# EAGLE design WSN_Gateway_v4.1 (EAGLE 8.2.2)
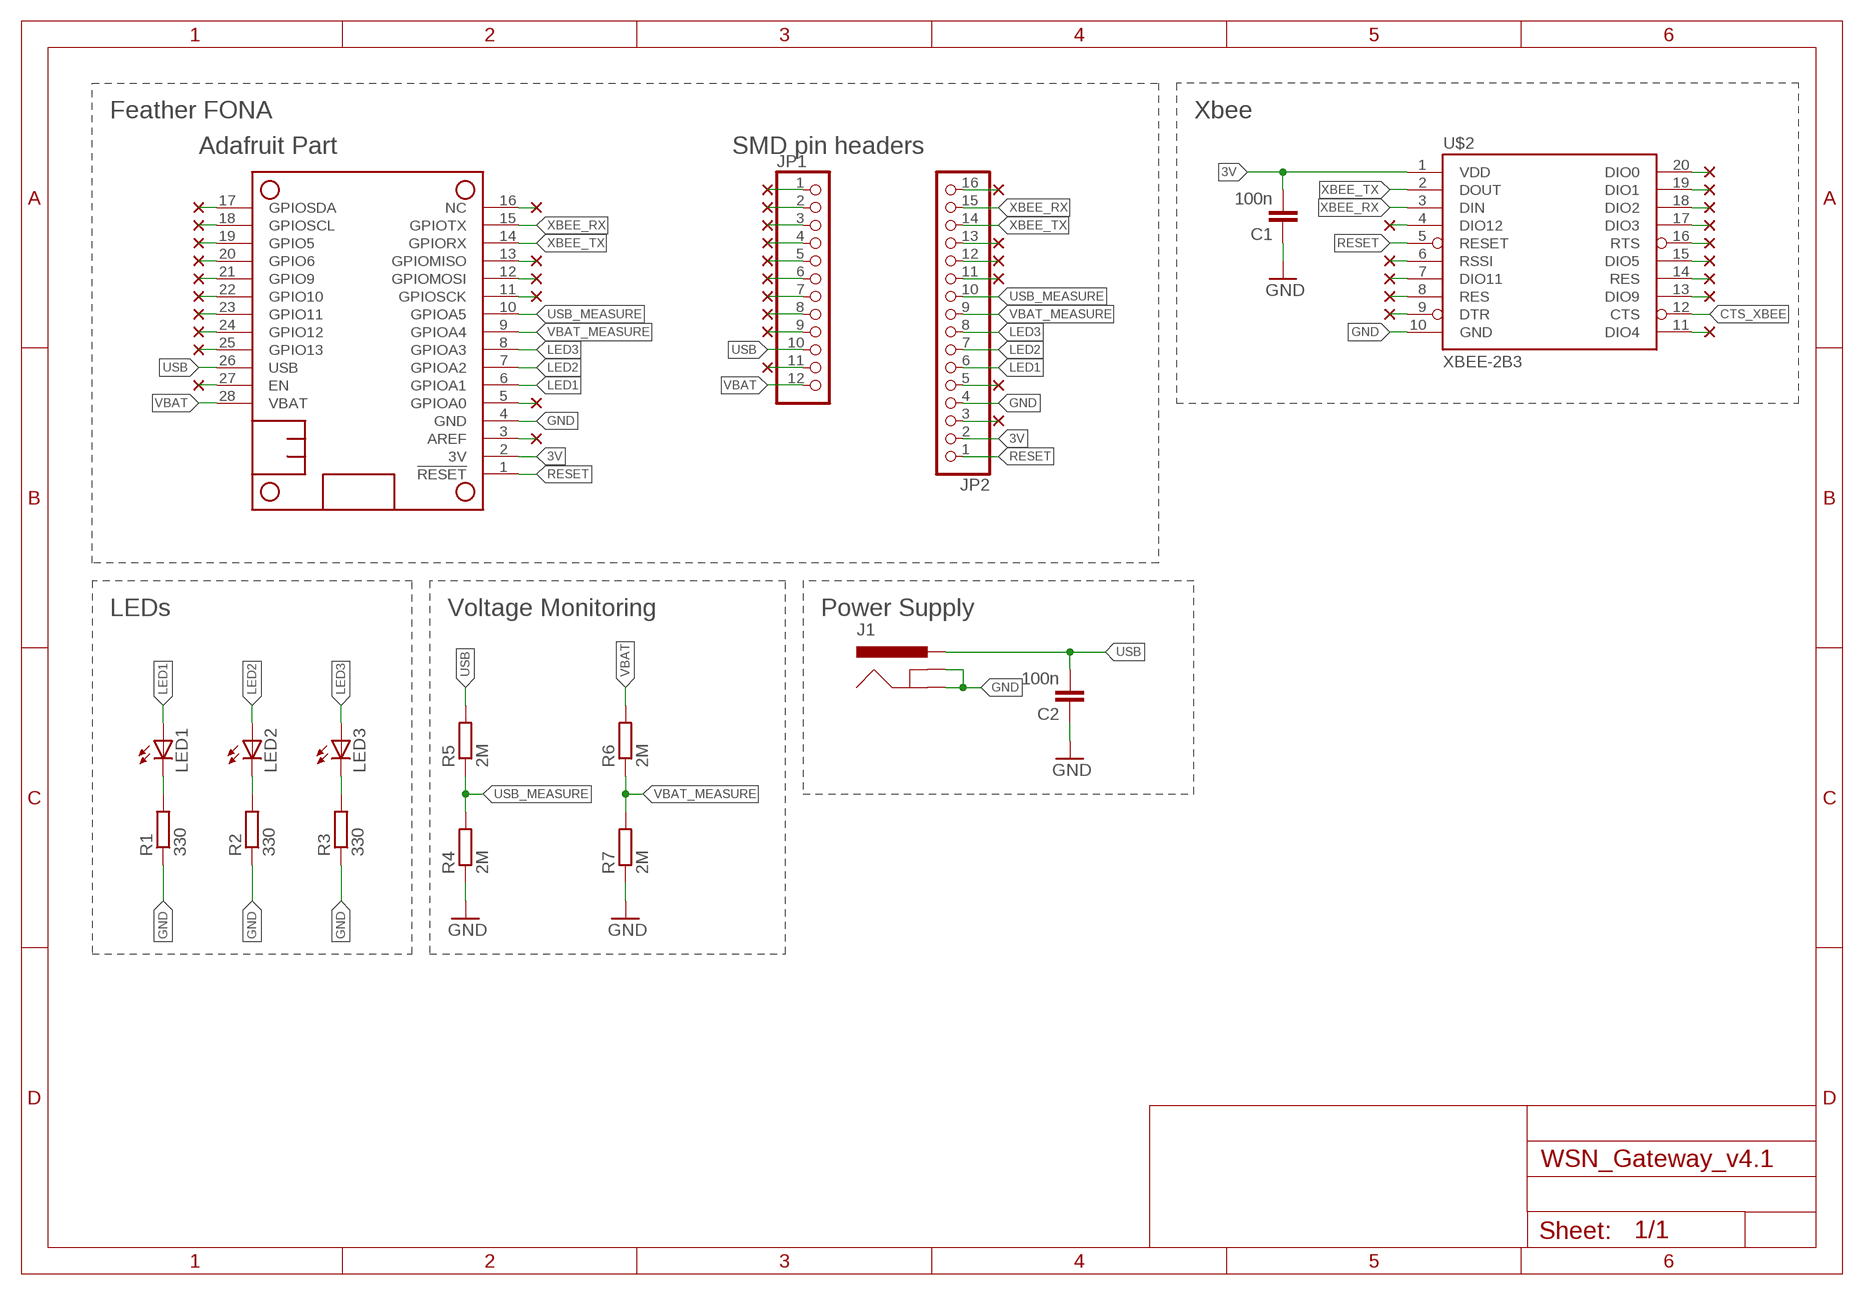
[diagram p0: schematic, sheet 1]

## Parts
C1  100n  C  [C0805]
C2  100n  C  [C0805]
J1  5.5x2.1mm Barrel  POWER_JACKSMD  [POWER_JACK_SMD]
JP1  PINHD-1X121X12_SMT  [1X12_SMT]
JP2  PINHD-1X161X16_SMT  [1X16_SMT]
LED1  LEDCHIPLED_0805  [CHIPLED_0805]
LED2  LEDCHIPLED_0805  [CHIPLED_0805]
LED3  LEDCHIPLED_0805  [CHIPLED_0805]
MS1  FEATHERWING_NODIM_NOHOLES  [FEATHERWING_DIM_2]
R1  330  R-EU_R0805  [R0805]
R2  330  R-EU_R0805  [R0805]
R3  330  R-EU_R0805  [R0805]
R4  2M  R-EU_R0805  [R0805]
R5  2M  R-EU_R0805  [R0805]
R6  2M  R-EU_R0805  [R0805]
R7  2M  R-EU_R0805  [R0805]
U$2  XBEE-2B3  [XBEE-SMD]

## Nets
3V: C1.2 JP2.2 MS1.2(3V) U$2.1(VDD)
CTS_XBEE: U$2.12(CTS)
GND: C1.1 C2.1 J1.GND(GNDBREAK) J1.P$4(GND) JP2.4 MS1.4(GND) R1.1 R2.1 R3.1 R4.1 R7.1 U$2.10(GND)
LED1: JP2.6 LED1.A MS1.6(GPIOA1)
LED2: JP2.7 LED2.A MS1.7(GPIOA2)
LED3: JP2.8 LED3.A MS1.8(GPIOA3)
N$1: LED1.C R1.2
N$2: LED2.C R2.2
N$3: LED3.C R3.2
N$4: MS1.25(GPIO13)
N$5: MS1.24(GPIO12)
N$6: MS1.23(GPIO11)
N$7: MS1.22(GPIO10)
N$8: MS1.21(GPIO9)
N$9: MS1.20(GPIO6)
N$10: MS1.19(GPIO5)
N$11: MS1.18(GPIOSCL)
N$12: MS1.17(GPIOSDA)
N$13: MS1.16(NC)
N$14: MS1.13(GPIOMISO)
N$15: MS1.12(GPIOMOSI)
N$16: MS1.11(GPIOSCK)
N$17: MS1.5(GPIOA0)
N$18: MS1.3(AREF)
N$19: JP1.1
N$20: MS1.27(EN)
N$21: JP1.2
N$22: JP1.3
N$23: JP1.4
N$24: JP1.5
N$25: JP1.6
N$26: JP1.7
N$27: JP1.8
N$28: JP1.9
N$29: U$2.6(RSSI)
N$30: JP1.11
N$31: U$2.4(DIO12)
N$32: JP2.16
N$33: U$2.7(DIO11)
N$34: U$2.8(RES)
N$35: JP2.13
N$36: JP2.12
N$37: JP2.11
N$38: U$2.9(DTR)
N$39: U$2.20(DIO0)
N$40: U$2.19(DIO1)
N$41: U$2.18(DIO2)
N$42: U$2.17(DIO3)
N$43: JP2.5
N$44: U$2.16(RTS)
N$45: JP2.3
N$46: U$2.15(DIO5)
N$47: U$2.14(RES)
N$48: U$2.13(DIO9)
N$49: U$2.11(DIO4)
RESET: JP2.1 MS1.1(!RESET) U$2.5(RESET)
USB: C2.2 J1.VIN0(PWR) J1.VIN1(PWR) JP1.10 MS1.26(USB) R5.2
USB_MEASURE: JP2.10 MS1.10(GPIOA5) R4.2 R5.1
VBAT: JP1.12 MS1.28(VBAT) R6.2
VBAT_MEASURE: JP2.9 MS1.9(GPIOA4) R6.1 R7.2
XBEE_RX: JP2.15 MS1.15(GPIOTX) U$2.3(DIN)
XBEE_TX: JP2.14 MS1.14(GPIORX) U$2.2(DOUT)

## Notes on the sheet
- Feather FONA | Xbee
- Adafruit Part | SMD pin headers
- LEDs | Voltage Monitoring | Power Supply

## Library data of the parts
C1 C2 = wsn:C: CAPACITOR, European symbol; SPICEMODEL: NONE; SPICEPREFIX: C
J1 = wsn:POWER_JACK: Power Jack This is the standard 5.5mm barrel jack for power. The PTH is the most common, proven, reliable, footprint. The Slot footprint only works if the mill layer is transmitted to the PCB fab house so be warned. Mating wall wart : TOL-00298 (and others); PROD_ID: CONN-08106; SF_ID: PRT-12748
JP1 = pinhead+:PINHD-1X12: PIN HEADER
JP2 = pinhead+:PINHD-1X16: PIN HEADER
LED1-LED3 = adafruit:LED: LED OSRAM: - CHIPLED LG R971, LG N971, LY N971, LG Q971, LY Q971, LO R971, LY R971 LH N974, LH R974 LS Q976, LO Q976, LY Q976 LO Q996 - Hyper CHIPLED LW Q18S LB Q993, LB Q99A, LB R99A - SideLED LS A670, LO A670, LY A670, LG A670, LP A670 LB A673, LV A673, LT A673, LW A673 LH A674 LY A675 LS A676, LA A676, LO A676, LY A676, LW A676 LS A679, LY A679, LG A679 - Hyper Micro SIDELED® LS Y876, LA Y876, LO Y876, LY Y876 LT Y87S - SmartLED LW L88C, LW L88S LB L89C, LB L89S, LG L890 LS L89K, LO L89K, LY L89K LS L896, LA L896, LO L896, LY L896 - TOPLED LS T670, LO T670, LY T670, LG T670, LP T670 LSG T670, LSP T670, LSY T670, LOP T670, LYG T670 LG T671, LOG T671, LSG T671 LB T673, LV T673, LT T673, LW T673 LH T674 LS T676, LA T676, LO T676, LY T676, LB T676, LH T676, LSB T676, LW T676 LB T67C, LV T67C, LT T67C, LS T67K, LO T67K, LY T67K, LW E67C LS E67B, LA E67B, LO E67B, LY E67B, LB E67C, LV E67C, LT E67C LW T67C LS T679, LY T679, LG T679 LS T770, LO T770, LY T770, LG T770, LP T770 LB T773, LV T773, LT T773, LW T773 LH T774 LS E675, LA E675, LY E675, LS T675 LS T776, LA T776, LO T776, LY T776, LB T776 LHGB T686 LT T68C, LB T68C - Hyper Mini TOPLED® LB M676 - Mini TOPLED Santana® LG M470 LS M47K, LO M47K, LY M47K Source: http://www.osram.convergy.de/
MS1 = adafruit:FEATHERWING
R1-R7 = rcl:R-EU_: RESISTOR, European symbol
U$2 = SparkFun-RF:XBEE-2: Xbee module footprints SMT header is CONN-09042.; PROD_ID: CONN-09042

## Board
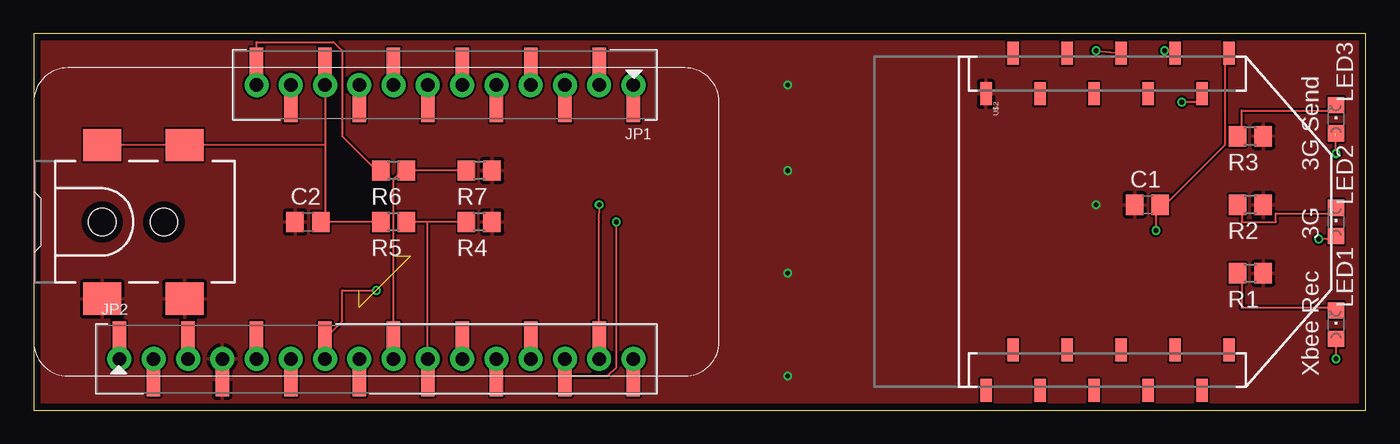
[diagram p1: board, top side]
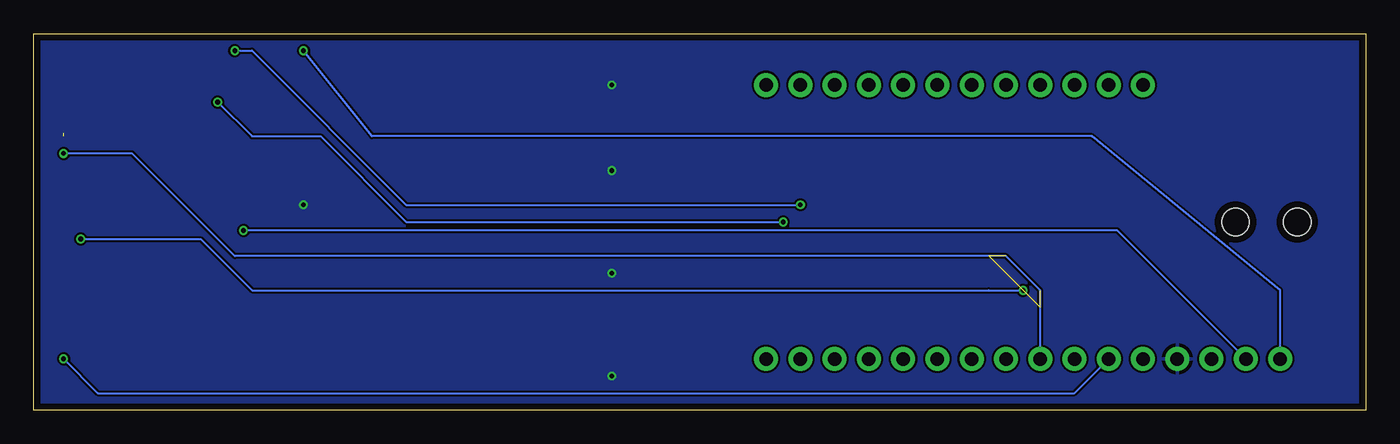
[diagram p2: board, bottom side, seen from below]

Size 98.73 x 27.93 mm. Coordinates in mm from the lower left corner, seen from the top.
Outline: 0,0 98.73,0 98.73,27.93 0,27.93 0,0
Copper layers (1*16): Top 0.035mm / dielectric 1.6mm / Bottom 0.035mm
Design rules "Elecrow_2-layer_PCB_eagle_rule": minimum track width 6mil, minimum drill 12mil, track to track 6mil, track to pad 6mil, pad to pad 6mil, via to via 8mil, smd to smd 0mil, copper to edge 20mil, drill to drill 10mil, minimum pad ring 6mil, minimum via ring 6mil, stop-mask expansion 0mil, vias tented up to drill 100mil, thermal gap 10mil

### Footprints (pad centres in the part's own frame; a part is rotated, then mirrored left to right if it is on the bottom)
C0805 = smd 1.3 x 1.5: 1 -0.95,0; 2 0.95,0
POWER_JACK_SMD = smd 2.8 x 2.4: GND 0,-5.7; P$4 6.1,-5.7; VIN0 0,5.7; VIN1 6.1,5.7 | hole 2.032: 0,0; 4.572,0
1X12_SMT = smd 1 x 2.5: 1 -13.97,1.52; 2 -11.43,-1.52; 3 -8.89,1.52; 4 -6.35,-1.52; 5 -3.81,1.52; 6 -1.27,-1.52; 7 1.27,1.52; 8 3.81,-1.52; 9 6.35,1.52; 10 8.89,-1.52; 11 11.43,1.52; 12 13.97,-1.52
1X16_SMT = smd 1 x 2.5: 1 -19.05,1.52; 2 -16.51,-1.52; 3 -13.97,1.52; 4 -11.43,-1.52; 5 -8.89,1.52; 6 -6.35,-1.52; 7 -3.81,1.52; 8 -1.27,-1.52; 9 1.27,1.52; 10 3.81,-1.52; 11 6.35,1.52; 12 8.89,-1.52; 13 11.43,1.52; 14 13.97,-1.52; 15 16.51,1.52; 16 19.05,-1.52
CHIPLED_0805 = smd 1.2 x 1.2: A 0,-1.05; C 0,1.05
FEATHERWING_DIM_2 = drill 1 pad 1.778: 1 6.35,1.27; 2 8.89,1.27; 3 11.43,1.27; 4 13.97,1.27; 5 16.51,1.27; 6 19.05,1.27; 7 21.59,1.27; 8 24.13,1.27; 9 26.67,1.27; 10 29.21,1.27; 11 31.75,1.27; 12 34.29,1.27; 13 36.83,1.27; 14 39.37,1.27; 15 41.91,1.27; 16 44.45,1.27; 17 44.45,21.59; 18 41.91,21.59; 19 39.37,21.59; 20 36.83,21.59; 21 34.29,21.59; 22 31.75,21.59; 23 29.21,21.59; 24 26.67,21.59; 25 24.13,21.59; 26 21.59,21.59; 27 19.05,21.59; 28 16.51,21.59
R0805 = smd 1.3 x 1.5: 1 -0.95,0; 2 0.95,0
XBEE-SMD = smd 1.7 x 0.85: 1 -12.5,20; 2 -9.5,18; 3 -12.5,16; 4 -9.5,14; 5 -12.5,12; 6 -9.5,10; 7 -12.5,8; 8 -9.5,6; 9 -12.5,4; 10 -9.5,2; 11 12.5,2; 12 9.5,4; 13 12.5,6; 14 9.5,8; 15 12.5,10; 16 9.5,12; 17 12.5,14; 18 9.5,16; 19 12.5,18; 20 9.5,20

### Placement (x,y rotation side)
C1  82.55,15.24 0 top
C2  20.32,13.97 0 top
J1  5.08,13.97 0 top
JP1  30.48,24.13 180 top
JP2  25.4,3.81 0 top
LED1  96.52,6.35 0 top
LED2  96.52,13.97 0 top
LED3  96.52,21.59 0 top
MS1  0,2.54 0 top
R1  90.17,10.16 180 top
R2  90.17,15.24 180 top
R3  90.17,20.32 180 top
R4  33.02,13.97 180 top
R5  26.67,13.97 180 top
R6  26.67,17.78 180 top
R7  33.02,17.78 180 top
U$2  68.58,13.97 270 top

### Tracks (layer width: path | path; a pad name or v marks a point on that pad's centre or on a via)
3V  (via drill 0.35)
  Top 0.152: MS1.2 JP2.2 | U$2.1 88.27,26.04 88.27,19.68 83.82,15.24 C1.2 83.19,15.24 v83.19,13.34
  Bottom 0.152: MS1.2 18.41,13.34 v83.19,13.34
GND  (via drill 0.35)
  other vias: 55.88,17.78 55.88,24.13 78.74,15.24 55.88,10.16 55.88,2.54
  pour Bottom: -2.54,30.48 101.6,30.48 101.6,-2.54 -2.54,-2.54
  pour Top: -1.27,29.21 100.33,29.21 100.33,-1.27 -1.27,-1.27
LED1  (via drill 0.35)
  Top 0.152: 96.52,5.71 LED1.A v96.52,3.81 | JP2.6 MS1.6
  Bottom 0.152: v96.52,3.81 93.98,1.27 21.59,1.27 MS1.6
LED2  (via drill 0.35)
  Top 0.152: MS1.7 JP2.7 22.86,6.6 22.86,8.89 v25.4,8.89 | LED2.A 96.3,12.7 v95.25,12.7
  Bottom 0.152: v95.25,12.7 86.36,12.7 82.55,8.89 27.94,8.89 v25.4,8.89
LED3  (via drill 0.35)  (4 unrouted)
  Top 0.152: MS1.8 JP2.8 | v96.52,19.05 96.52,20.32
  Bottom 0.152: MS1.8 24.13,8.89 26.67,11.43 83.82,11.43 91.44,19.05 v96.52,19.05
N$1
  Top 0.152: LED1.C 96.52,7.62 89.53,7.62 89.53,10.16 R1.2
N$2
  Top 0.152: LED2.C 96.52,14.61 92.08,14.61 92.08,13.97 89.53,13.97 89.53,15.24 R2.2
N$3
  Top 0.152: LED3.C 96.52,22.23 89.53,22.23 89.53,20.32 R3.2
RESET  (via drill 0.35)
  Top 0.152: 80.64,26.04 U$2.5 v78.74,26.67 | MS1.1 JP2.1
  Bottom 0.152: MS1.1 6.35,8.89 20.32,20.32 73.66,20.32 v78.74,26.67
USB
  Top 0.152: J1.VIN0 5.08,19.68 10.79,19.68 J1.VIN1 11.43,19.68 21.59,19.68 | R5.2 21.59,13.97 | JP1.10 MS1.26 21.59,19.68 | 21.59,19.68 21.59,13.97 | 21.59,13.97 C2.2
USB_MEASURE
  Top 0.152: R4.2 29.21,13.97 | 29.21,13.97 R5.1 | JP2.10 MS1.10 29.21,13.97
VBAT
  Top 0.152: R6.2 25.4,17.78 22.86,20.32 22.86,26.67 22.23,27.3 16.51,27.3 JP1.12 MS1.28
VBAT_MEASURE
  Top 0.152: R7.2 R6.1 27.3,17.78 26.67,17.14 JP2.9 MS1.9
XBEE_RX  (via drill 0.35)
  Top 0.152: 84.45,26.04 U$2.3 v83.82,26.67 | MS1.15 JP2.15 41.91,13.97 41.91,14.61 v41.91,15.24
  Bottom 0.152: v83.82,26.67 82.55,26.67 71.12,15.24 v41.91,15.24
XBEE_TX  (via drill 0.35)
  Top 0.152: v43.18,13.97 43.18,3.17 42.55,2.54 39.37,2.54 | U$2.2 86.36,22.86 v85.09,22.86 | 39.37,2.54 MS1.14 | 39.37,2.54 JP2.14
  Bottom 0.152: v85.09,22.86 82.55,20.32 77.47,20.32 71.12,13.97 v43.18,13.97

### Text on the board
tPlace: 3G Send | 3G | Xbee Rec